# EasyEDA schematic R-2R Ladder V2.json
TITLE: Sheet_1; REV: 1.0; Date: 2024-09-17; Sheet: 1/1; Drawn By: evanmalcolm08; Company: Your Company
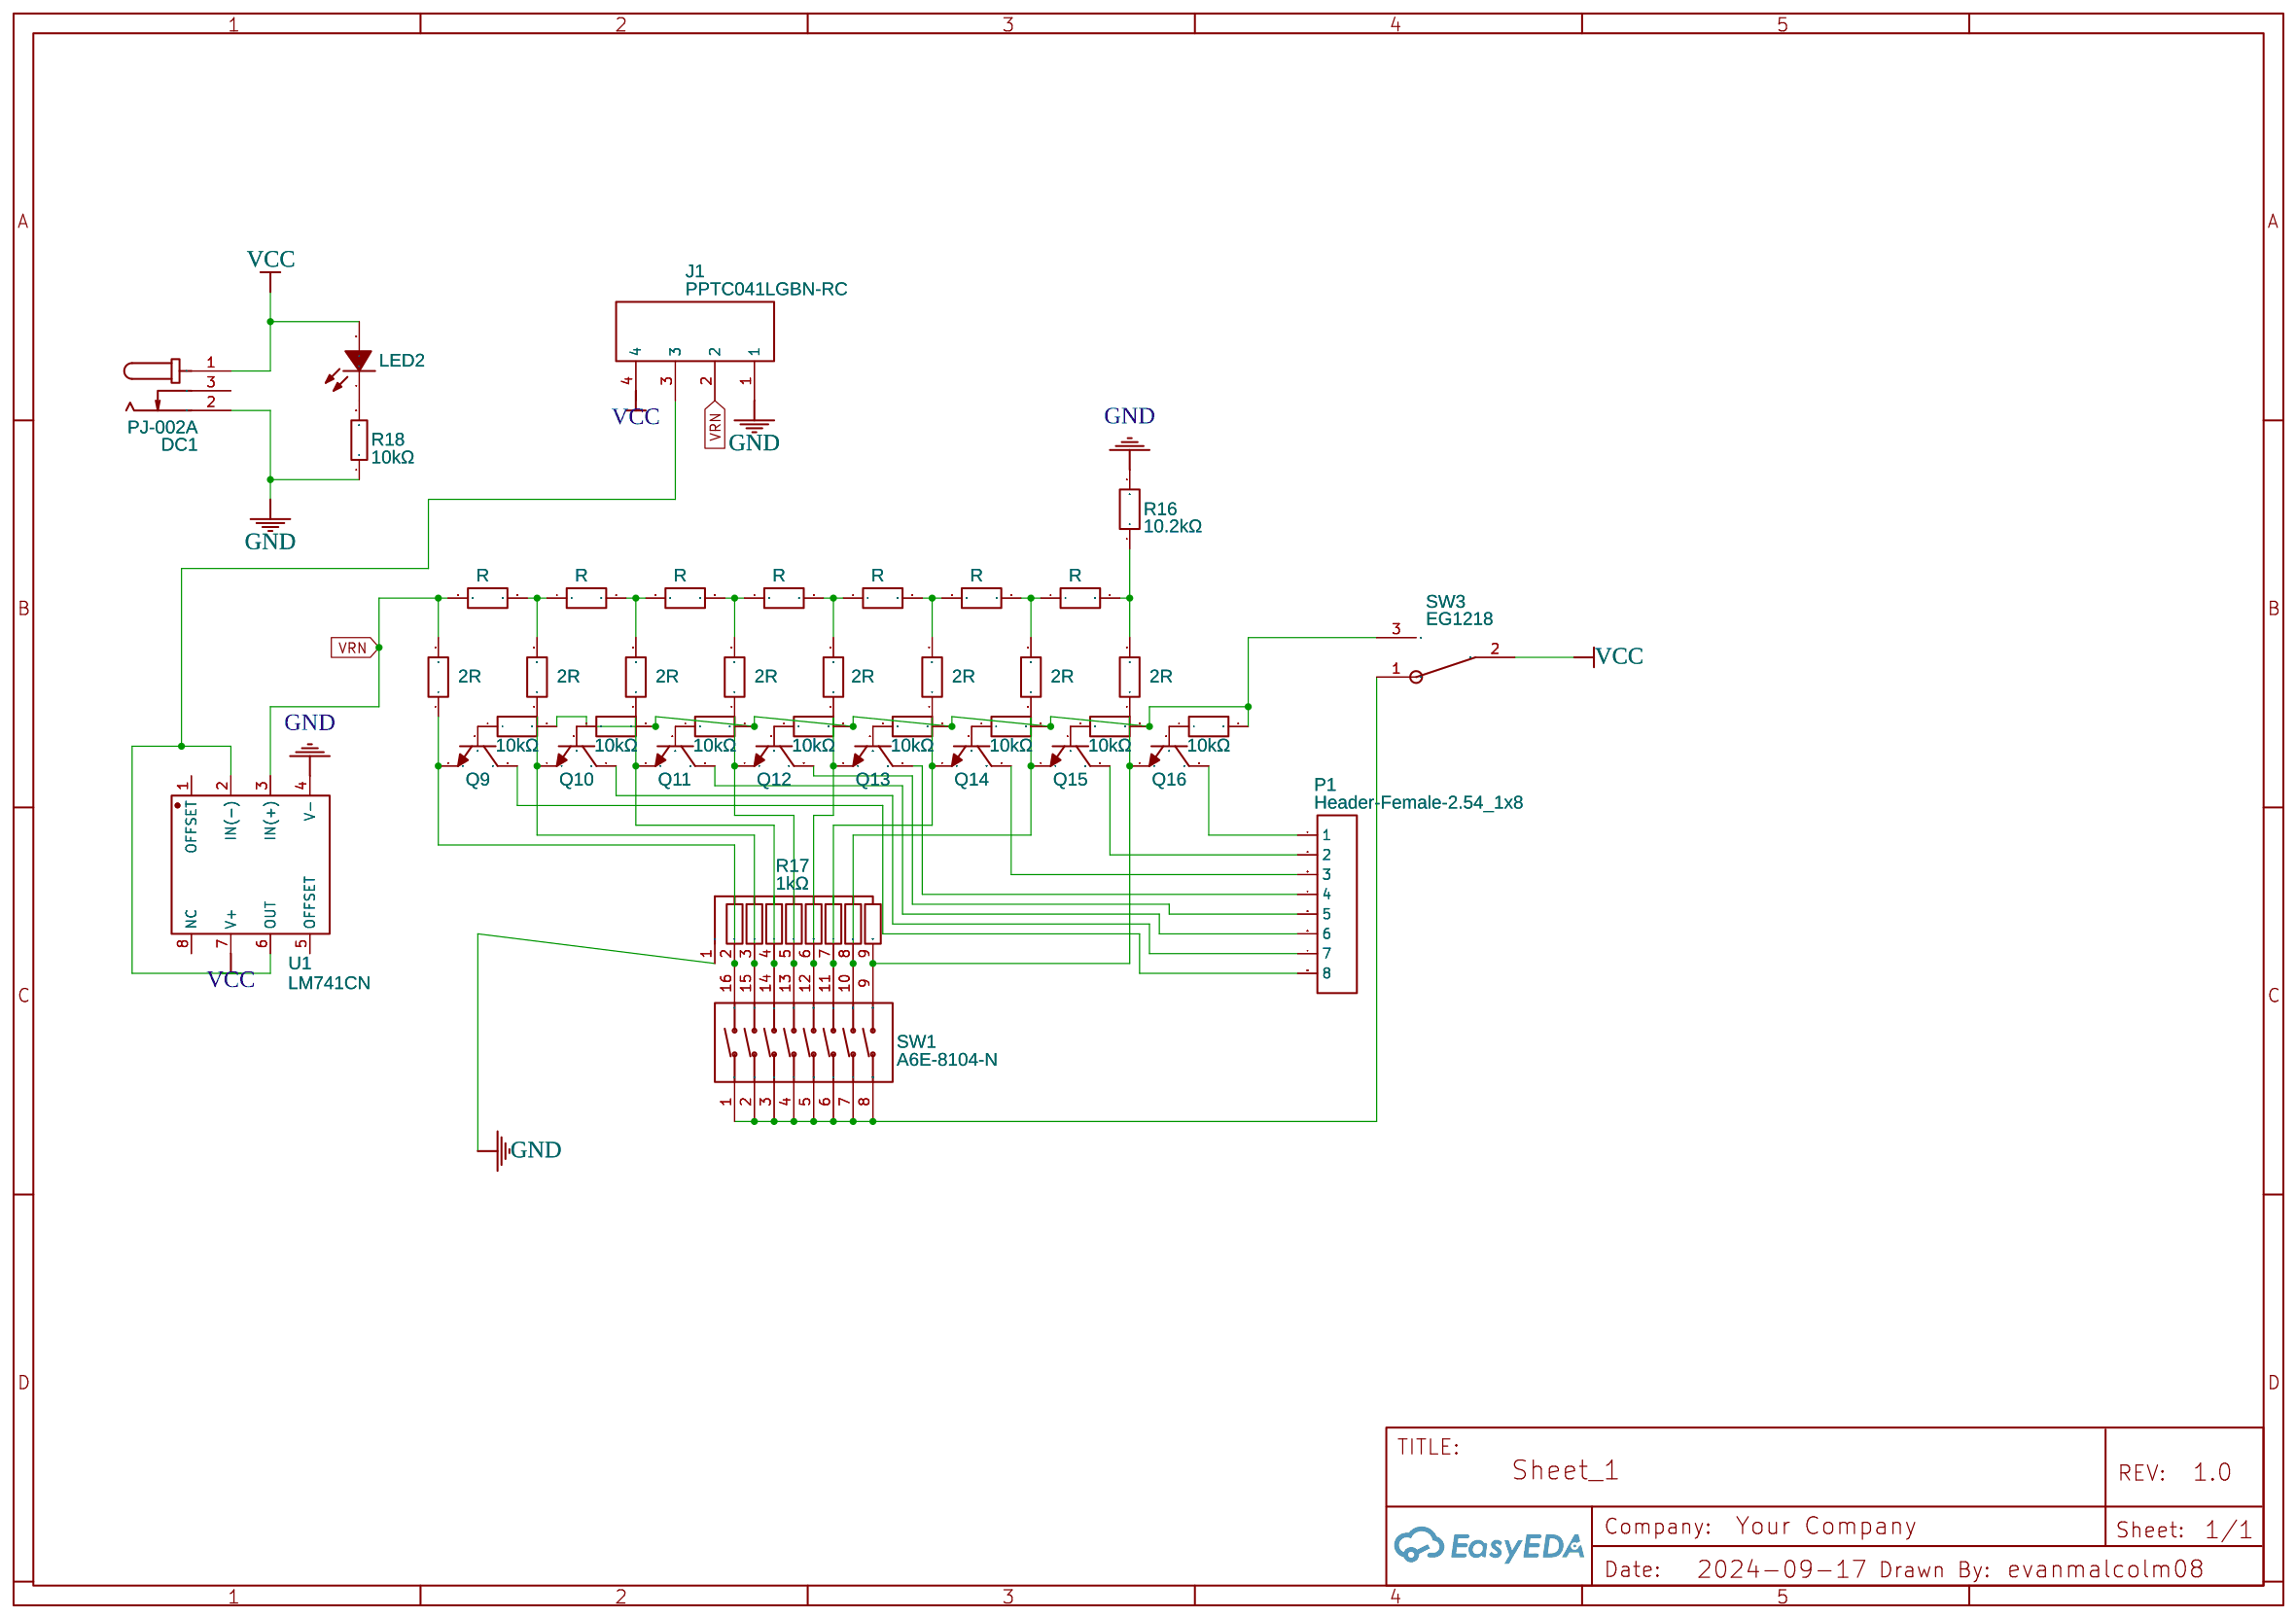
[diagram p0: schematic sheet]

## Parts
DC1  PJ-002A  [DC-IN-TH_PJ-002A]
J1  PPTC041LGBN-RC  [PPTC041LGBN-RC]
LED2  LTST-C150TBKT  [LED1206-RD_BLUE]
P1  Header-Female-2.54_1x8  [HDR-TH_8P-P2.54-V-F-1]
Q9  2N3904TF  [TO-92-3_L5.1-W4.1-P1.27-L]
Q10  2N3904TF  [TO-92-3_L5.1-W4.1-P1.27-L]
Q11  2N3904TF  [TO-92-3_L5.1-W4.1-P1.27-L]
Q12  2N3904TF  [TO-92-3_L5.1-W4.1-P1.27-L]
Q13  2N3904TF  [TO-92-3_L5.1-W4.1-P1.27-L]
Q14  2N3904TF  [TO-92-3_L5.1-W4.1-P1.27-L]
Q15  2N3904TF  [TO-92-3_L5.1-W4.1-P1.27-L]
Q16  2N3904TF  [TO-92-3_L5.1-W4.1-P1.27-L]
R1  R  [RES-TH_BD2.3-L6.0-P10.00-D0.4]
R2  R  [RES-TH_BD2.3-L6.0-P10.00-D0.4]
R3  R  [RES-TH_BD2.3-L6.0-P10.00-D0.4]
R4  R  [RES-TH_BD2.3-L6.0-P10.00-D0.4]
R5  R  [RES-TH_BD2.3-L6.0-P10.00-D0.4]
R6  R  [RES-TH_BD2.3-L6.0-P10.00-D0.4]
R7  R  [RES-TH_BD2.3-L6.0-P10.00-D0.4]
R8  2R  [RES-TH_BD2.3-L6.0-P10.00-D0.4]
R9  2R  [RES-TH_BD2.3-L6.0-P10.00-D0.4]
R10  2R  [RES-TH_BD2.3-L6.0-P10.00-D0.4]
R11  2R  [RES-TH_BD2.3-L6.0-P10.00-D0.4]
R12  2R  [RES-TH_BD2.3-L6.0-P10.00-D0.4]
R13  2R  [RES-TH_BD2.3-L6.0-P10.00-D0.4]
R14  2R  [RES-TH_BD2.3-L6.0-P10.00-D0.4]
R15  2R  [RES-TH_BD2.3-L6.0-P10.00-D0.4]
R16  10.2kΩ  [RES-TH_BD2.3-L6.0-P10.00-D0.4]
R17  1kΩ  [RES-ARRAY-TH_9P-L22.8-W3.00-P2.54]
R18  10kΩ  [R1206]
R27  10kΩ  [RES-TH_BD2.3-L6.0-P10.00-D0.4]
R28  10kΩ  [RES-TH_BD2.3-L6.0-P10.00-D0.4]
R29  10kΩ  [RES-TH_BD2.3-L6.0-P10.00-D0.4]
R30  10kΩ  [RES-TH_BD2.3-L6.0-P10.00-D0.4]
R31  10kΩ  [RES-TH_BD2.3-L6.0-P10.00-D0.4]
R32  10kΩ  [RES-TH_BD2.3-L6.0-P10.00-D0.4]
R33  10kΩ  [RES-TH_BD2.3-L6.0-P10.00-D0.4]
R34  10kΩ  [RES-TH_BD2.3-L6.0-P10.00-D0.4]
SW1  A6E-8104-N  [SW-TH_16P-L21.9-W9.9-P2.54-LS7.6]
SW3  EG1218  [SW-TH_EG1218]
U1  LM741CN  [DIP-8_L9.8-W6.6-P2.54-LS7.6-BL]

## Library data of the parts
DC1 = PJ-002A: Supplier: LCSC; Supplier Part: C3096082; Manufacturer: CUI; Contributor: lcsc; JLCPCB Part Class: Extended Part
J1 = PPTC041LGBN-RC: Contributor: sunggunlee
LED2 = LTST-C150TBKT: Contributor: LCSC; Supplier: LCSC; Manufacturer: LITEON(光宝); Supplier Part: C125088; JLCPCB Part Class: Extended Part
P1 = Header-Female-2.54_1x8: Supplier: LCSC; Manufacturer: BOOMELE(博穆精密); Manufacturer Part: 2.54-1*8P母环保; Supplier Part: C27438; JLCPCB Part Class: Extended Part
Q9-Q16 = 2N3904TF: Contributor: LCSC; Supplier: LCSC; Supplier Part: C900703; Manufacturer: onsemi(安森美); JLCPCB Part Class: Extended Part
R1-R16 R27-R34 = CF14JT10K0: Contributor: lcsc; Supplier: LCSC; Supplier Part: C2441283; Manufacturer: SEI(Stackpole Electronics Inc.); JLCPCB Part Class: Extended Part
R17 = 4609X-101-102LF: Contributor: lcsc; Supplier: LCSC; Supplier Part: C840661; Manufacturer: BOURNS; JLCPCB Part Class: Extended Part
R18 = CR1206-FX-1002ELF: Contributor: LCSC; Supplier: LCSC; Supplier Part: C205047; Manufacturer: BOURNS; JLCPCB Part Class: Extended Part
SW1 = A6E-8104-N: Contributor: lcsc; Supplier: LCSC; Supplier Part: C3312320; Manufacturer: OMRON(欧姆龙); JLCPCB Part Class: Extended Part
SW3 = EG1218: Contributor: LCSC; Supplier: LCSC; Supplier Part: C273394; Manufacturer: E-Switch; JLCPCB Part Class: Extended Part
U1 = LM741CN: sourceId: DPJ1jBuM4; Supplier: LCSC; Manufacturer: TI(德州仪器); Manufacturer Part: LM741CN/NOPB; Supplier Part: C13974; JLCPCB Part Class: Extended Part

## Nets
GND: DC1.2 J1.1 R16.2 R17.1 R18.1 U1.4(V-)
VCC: DC1.1 LED2.2(A) SW3.2 U1.7(V+)
VRN: J1.2 R1.1 R8.2 U1.3(IN(+))
Net-(J1-3): J1.3 U1.2(IN(-)) U1.6(OUT)
Net-(LED2-1): LED2.1(K) R18.2
Net-(P1-1): P1.1 Q16.3(C)
Net-(P1-2): P1.2 Q15.3(C)
Net-(P1-3): P1.3 Q14.3(C)
Net-(P1-4): P1.4 Q13.3(C)
Net-(P1-5): P1.5 Q12.3(C)
Net-(P1-6): P1.6 Q11.3(C)
Net-(P1-7): P1.7 Q10.3(C)
Net-(P1-8): P1.8 Q9.3(C)
Net-(Q9-1): Q9.1(E) R8.1 R17.2 SW1.16
Net-(Q9-2): Q9.2(B) R34.1
Net-(Q10-1): Q10.1(E) R9.1 R17.3 SW1.15
Net-(Q10-2): Q10.2(B) R33.1
Net-(Q11-1): Q11.1(E) R10.1 R17.4 SW1.14
Net-(Q11-2): Q11.2(B) R32.1
Net-(Q12-1): Q12.1(E) R11.1 R17.5 SW1.13
Net-(Q12-2): Q12.2(B) R31.1
Net-(Q13-1): Q13.1(E) R12.1 R17.6 SW1.12
Net-(Q13-2): Q13.2(B) R30.1
Net-(Q14-1): Q14.1(E) R13.1 R17.7 SW1.11
Net-(Q14-2): Q14.2(B) R29.1
Net-(Q15-1): Q15.1(E) R14.1 R17.8 SW1.10
Net-(Q15-2): Q15.2(B) R28.1
Net-(Q16-1): Q16.1(E) R15.1 R17.9 SW1.9
Net-(Q16-2): Q16.2(B) R27.1
Net-(R1-2): R1.2 R2.1 R9.2
Net-(R2-2): R2.2 R3.1 R10.2
Net-(R3-2): R3.2 R4.1 R11.2
Net-(R4-2): R4.2 R5.1 R12.2
Net-(R5-2): R5.2 R6.1 R13.2
Net-(R6-2): R6.2 R7.1 R14.2
Net-(R7-2): R7.2 R15.2 R16.1
Net-(R27-2): R27.2 R28.2 R29.2 R30.2 R31.2 R32.2 R33.2 R34.2 SW3.3
Net-(SW1-1): SW1.1 SW1.2 SW1.3 SW1.4 SW1.5 SW1.6 SW1.7 SW1.8 SW3.1

Not connected (* = marked no-connect by the designer): DC1 3; J1 4; U1 1(OFFSET) 5(OFFSET) 8(NC)
